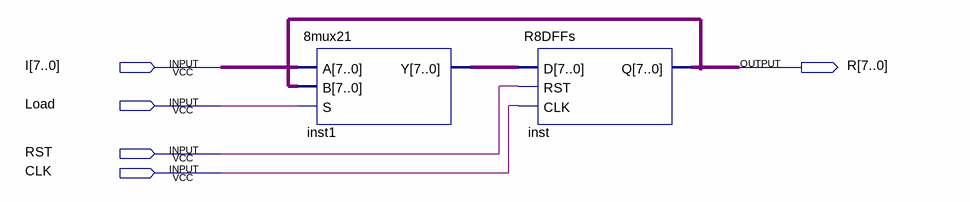
[diagram p0: schematic sheet]
// Quartus schematic Register8.bdf as structural Verilog: 2 symbols, 5 pins
module Register8 (
  input  [7:0] I,
  input  Load,
  input  RST,
  input  CLK,
  output [7:0] R
);

  wire [7:0] inst1_y;

  \8mux21  inst1 (.A(I), .B(R), .S(Load), .Y(inst1_y));
  R8DFFs inst (.D(inst1_y), .RST(RST), .CLK(CLK), .Q(R));
endmodule
